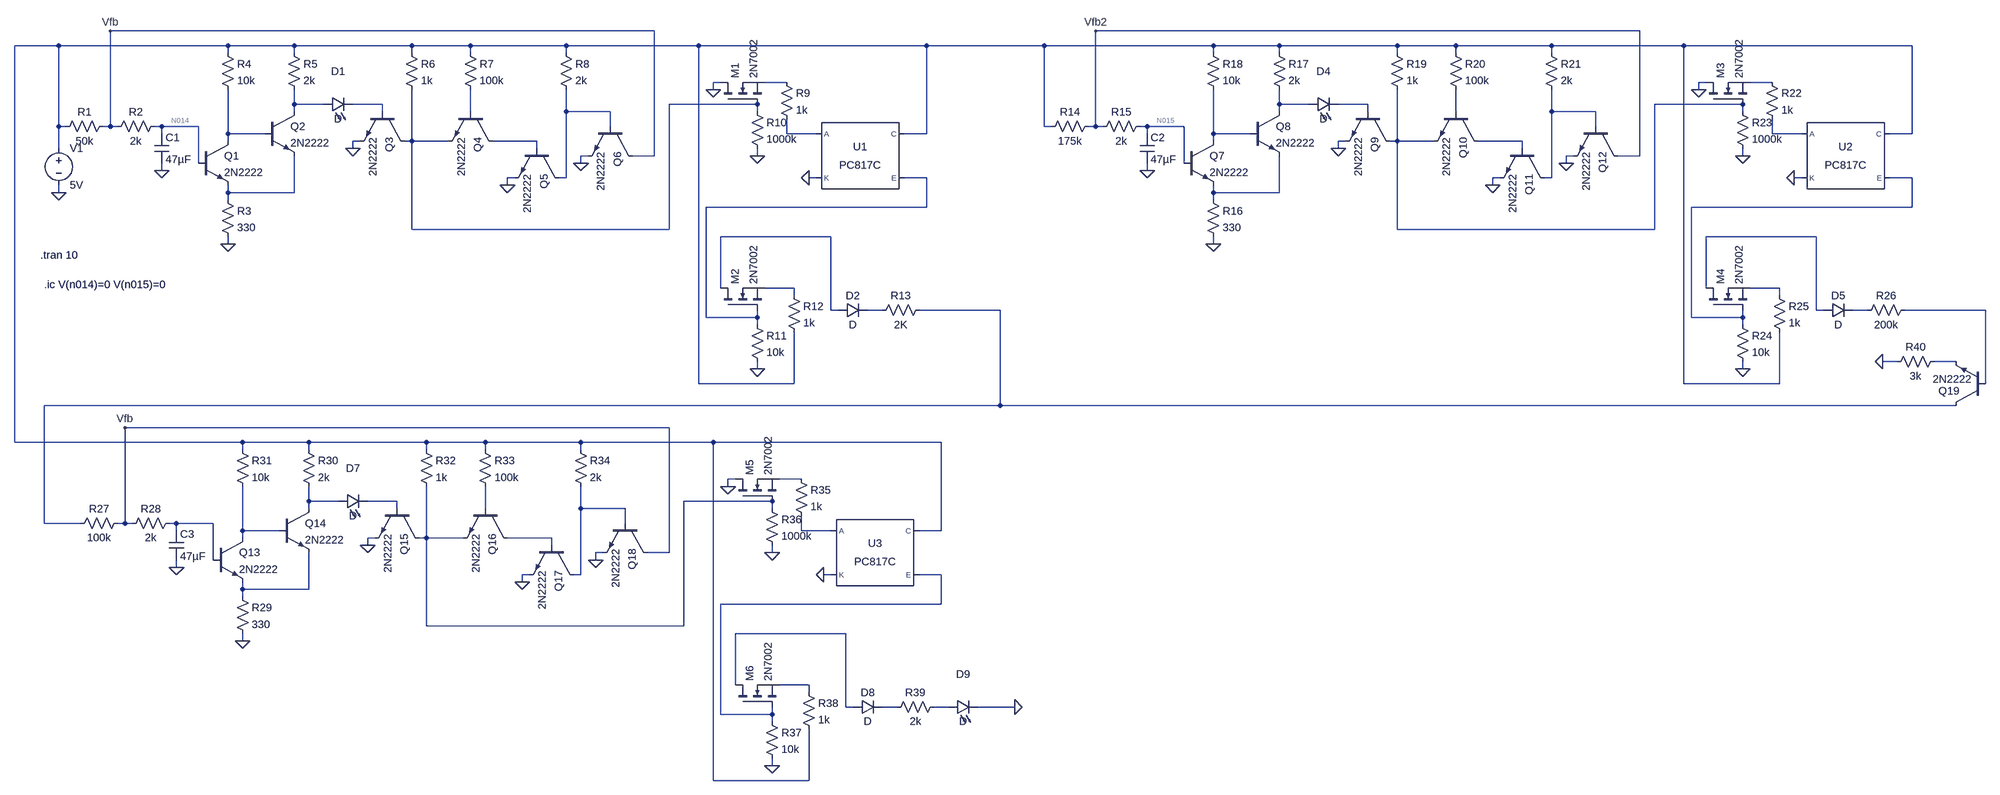
[diagram p0: schematic NeuronSynapseVersion5.asc]
NeuronSynapseVersion5.asc, the LTspice schematic file:
Version 4.1
SHEET 1 5048 1508
WIRE 1440 -128 256 -128
WIRE 3584 -128 2400 -128
WIRE 144 -96 48 -96
WIRE 512 -96 144 -96
WIRE 656 -96 512 -96
WIRE 912 -96 656 -96
WIRE 1040 -96 912 -96
WIRE 1248 -96 1040 -96
WIRE 1536 -96 1248 -96
WIRE 2032 -96 1536 -96
WIRE 2288 -96 2032 -96
WIRE 2656 -96 2288 -96
WIRE 2800 -96 2656 -96
WIRE 3056 -96 2800 -96
WIRE 3184 -96 3056 -96
WIRE 3392 -96 3184 -96
WIRE 3680 -96 3392 -96
WIRE 4176 -96 3680 -96
WIRE 512 -80 512 -96
WIRE 656 -80 656 -96
WIRE 912 -80 912 -96
WIRE 1040 -80 1040 -96
WIRE 1248 -80 1248 -96
WIRE 2656 -80 2656 -96
WIRE 2800 -80 2800 -96
WIRE 3056 -80 3056 -96
WIRE 3184 -80 3184 -96
WIRE 3392 -80 3392 -96
WIRE 1584 -16 1568 -16
WIRE 1728 -16 1680 -16
WIRE 3728 -16 3712 -16
WIRE 3872 -16 3824 -16
WIRE 1568 0 1568 -16
WIRE 3712 0 3712 -16
WIRE 656 32 656 0
WIRE 720 32 656 32
WIRE 848 32 784 32
WIRE 1664 32 1472 32
WIRE 2800 32 2800 0
WIRE 2864 32 2800 32
WIRE 2992 32 2928 32
WIRE 3808 32 3616 32
WIRE 656 48 656 32
WIRE 848 48 848 32
WIRE 1040 48 1040 0
WIRE 1248 48 1248 0
WIRE 1344 48 1248 48
WIRE 1664 48 1664 32
WIRE 2800 48 2800 32
WIRE 2992 48 2992 32
WIRE 3184 48 3184 0
WIRE 3392 48 3392 0
WIRE 3488 48 3392 48
WIRE 3808 48 3808 32
WIRE 144 80 144 -96
WIRE 160 80 144 80
WIRE 256 80 256 -128
WIRE 256 80 240 80
WIRE 272 80 256 80
WIRE 368 80 352 80
WIRE 448 80 368 80
WIRE 1344 80 1344 48
WIRE 2288 80 2288 -96
WIRE 2304 80 2288 80
WIRE 2400 80 2400 -128
WIRE 2400 80 2384 80
WIRE 2416 80 2400 80
WIRE 2512 80 2496 80
WIRE 2592 80 2512 80
WIRE 3488 80 3488 48
WIRE 368 96 368 80
WIRE 512 96 512 0
WIRE 592 96 512 96
WIRE 1728 96 1728 64
WIRE 1792 96 1728 96
WIRE 2032 96 2032 -96
WIRE 2032 96 1984 96
WIRE 2512 96 2512 80
WIRE 2656 96 2656 0
WIRE 2736 96 2656 96
WIRE 3872 96 3872 64
WIRE 3936 96 3872 96
WIRE 4176 96 4176 -96
WIRE 4176 96 4128 96
WIRE 512 112 512 96
WIRE 800 112 784 112
WIRE 912 112 912 0
WIRE 912 112 896 112
WIRE 992 112 912 112
WIRE 1184 112 1088 112
WIRE 2656 112 2656 96
WIRE 2944 112 2928 112
WIRE 3056 112 3056 0
WIRE 3056 112 3040 112
WIRE 3136 112 3056 112
WIRE 3328 112 3232 112
WIRE 144 128 144 80
WIRE 784 128 784 112
WIRE 1184 128 1184 112
WIRE 2928 128 2928 112
WIRE 3328 128 3328 112
WIRE 1296 144 1280 144
WIRE 1440 144 1440 -128
WIRE 1440 144 1392 144
WIRE 1664 144 1664 128
WIRE 3440 144 3424 144
WIRE 3584 144 3584 -128
WIRE 3584 144 3536 144
WIRE 3808 144 3808 128
WIRE 448 160 448 80
WIRE 1280 160 1280 144
WIRE 2592 160 2592 80
WIRE 3424 160 3424 144
WIRE 368 176 368 160
WIRE 2512 176 2512 160
WIRE 1136 192 1120 192
WIRE 1248 192 1248 48
WIRE 1248 192 1232 192
WIRE 1792 192 1776 192
WIRE 2032 192 1984 192
WIRE 3280 192 3264 192
WIRE 3392 192 3392 48
WIRE 3392 192 3376 192
WIRE 3936 192 3920 192
WIRE 4176 192 4128 192
WIRE 1120 208 1120 192
WIRE 3264 208 3264 192
WIRE 144 224 144 208
WIRE 512 224 512 208
WIRE 656 224 656 144
WIRE 656 224 512 224
WIRE 2656 224 2656 208
WIRE 2800 224 2800 144
WIRE 2800 224 2656 224
WIRE 512 240 512 224
WIRE 2656 240 2656 224
WIRE 2032 256 2032 192
WIRE 2032 256 1552 256
WIRE 4176 256 4176 192
WIRE 4176 256 3696 256
WIRE 912 304 912 112
WIRE 1472 304 1472 32
WIRE 1472 304 912 304
WIRE 3056 304 3056 112
WIRE 3616 304 3616 32
WIRE 3616 304 3056 304
WIRE 1824 320 1584 320
WIRE 3968 320 3728 320
WIRE 512 336 512 320
WIRE 2656 336 2656 320
WIRE 1584 432 1584 320
WIRE 1744 432 1680 432
WIRE 3728 432 3728 320
WIRE 3888 432 3824 432
WIRE 1744 448 1744 432
WIRE 3888 448 3888 432
WIRE 1824 480 1824 320
WIRE 1840 480 1824 480
WIRE 1936 480 1904 480
WIRE 2192 480 2016 480
WIRE 3968 480 3968 320
WIRE 3984 480 3968 480
WIRE 4080 480 4048 480
WIRE 4336 480 4160 480
WIRE 1552 496 1552 256
WIRE 1664 496 1664 480
WIRE 1664 496 1552 496
WIRE 3696 496 3696 256
WIRE 3808 496 3808 480
WIRE 3808 496 3696 496
WIRE 1664 512 1664 496
WIRE 3808 512 3808 496
WIRE 4144 592 4112 592
WIRE 4272 592 4224 592
WIRE 1664 608 1664 592
WIRE 3808 608 3808 592
WIRE 1536 640 1536 -96
WIRE 1744 640 1744 528
WIRE 1744 640 1536 640
WIRE 3680 640 3680 -96
WIRE 3888 640 3888 528
WIRE 3888 640 3680 640
WIRE 4336 640 4336 480
WIRE 2192 688 2192 480
WIRE 2192 688 112 688
WIRE 4272 688 2192 688
WIRE 1472 736 288 736
WIRE 48 768 48 -96
WIRE 544 768 48 768
WIRE 688 768 544 768
WIRE 944 768 688 768
WIRE 1072 768 944 768
WIRE 1280 768 1072 768
WIRE 1568 768 1280 768
WIRE 2064 768 1568 768
WIRE 544 784 544 768
WIRE 688 784 688 768
WIRE 944 784 944 768
WIRE 1072 784 1072 768
WIRE 1280 784 1280 768
WIRE 1616 848 1600 848
WIRE 1760 848 1712 848
WIRE 1600 864 1600 848
WIRE 688 896 688 864
WIRE 752 896 688 896
WIRE 880 896 816 896
WIRE 1696 896 1504 896
WIRE 688 912 688 896
WIRE 880 912 880 896
WIRE 1072 912 1072 864
WIRE 1280 912 1280 864
WIRE 1376 912 1280 912
WIRE 1696 912 1696 896
WIRE 112 944 112 688
WIRE 192 944 112 944
WIRE 288 944 288 736
WIRE 288 944 272 944
WIRE 304 944 288 944
WIRE 400 944 384 944
WIRE 480 944 400 944
WIRE 1376 944 1376 912
WIRE 400 960 400 944
WIRE 544 960 544 864
WIRE 624 960 544 960
WIRE 1760 960 1760 928
WIRE 1824 960 1760 960
WIRE 2064 960 2064 768
WIRE 2064 960 2016 960
WIRE 544 976 544 960
WIRE 832 976 816 976
WIRE 944 976 944 864
WIRE 944 976 928 976
WIRE 1024 976 944 976
WIRE 1216 976 1120 976
WIRE 816 992 816 976
WIRE 1216 992 1216 976
WIRE 1328 1008 1312 1008
WIRE 1472 1008 1472 736
WIRE 1472 1008 1424 1008
WIRE 1696 1008 1696 992
WIRE 480 1024 480 944
WIRE 1312 1024 1312 1008
WIRE 400 1040 400 1024
WIRE 1168 1056 1152 1056
WIRE 1280 1056 1280 912
WIRE 1280 1056 1264 1056
WIRE 1824 1056 1808 1056
WIRE 2064 1056 2016 1056
WIRE 1152 1072 1152 1056
WIRE 544 1088 544 1072
WIRE 688 1088 688 1008
WIRE 688 1088 544 1088
WIRE 544 1104 544 1088
WIRE 2064 1120 2064 1056
WIRE 2064 1120 1584 1120
WIRE 944 1168 944 976
WIRE 1504 1168 1504 896
WIRE 1504 1168 944 1168
WIRE 1856 1184 1616 1184
WIRE 544 1200 544 1184
WIRE 1616 1296 1616 1184
WIRE 1776 1296 1712 1296
WIRE 1776 1312 1776 1296
WIRE 1856 1344 1856 1184
WIRE 1872 1344 1856 1344
WIRE 1968 1344 1936 1344
WIRE 2080 1344 2048 1344
WIRE 2224 1344 2144 1344
WIRE 1584 1360 1584 1120
WIRE 1696 1360 1696 1344
WIRE 1696 1360 1584 1360
WIRE 1696 1376 1696 1360
WIRE 1696 1472 1696 1456
WIRE 1568 1504 1568 768
WIRE 1776 1504 1776 1392
WIRE 1776 1504 1568 1504
FLAG 144 224 0
FLAG 368 176 0
FLAG 512 336 0
FLAG 784 128 0
FLAG 1120 208 0
FLAG 1280 160 0
FLAG 1568 0 0
FLAG 1664 144 0
FLAG 256 -128 Vfb
FLAG 1664 608 0
FLAG 1776 192 0
FLAG 2512 176 0
FLAG 2656 336 0
FLAG 2928 128 0
FLAG 3264 208 0
FLAG 3424 160 0
FLAG 3712 0 0
FLAG 3808 144 0
FLAG 2400 -128 Vfb2
FLAG 3808 608 0
FLAG 3920 192 0
FLAG 400 1040 0
FLAG 544 1200 0
FLAG 816 992 0
FLAG 1152 1072 0
FLAG 1312 1024 0
FLAG 1600 864 0
FLAG 1696 1008 0
FLAG 288 736 Vfb
FLAG 1696 1472 0
FLAG 2224 1344 0
FLAG 1808 1056 0
FLAG 4112 592 0
SYMBOL voltage 144 112 R0
WINDOW 123 0 0 Left 0
WINDOW 39 0 0 Left 0
SYMATTR InstName V1
SYMATTR Value 5V
SYMBOL res 256 64 R90
WINDOW 0 0 56 VBottom 2
WINDOW 3 32 56 VTop 2
SYMATTR InstName R1
SYMATTR Value 50k
SYMBOL res 368 64 R90
WINDOW 0 0 56 VBottom 2
WINDOW 3 32 56 VTop 2
SYMATTR InstName R2
SYMATTR Value 2k
SYMBOL cap 352 96 R0
SYMATTR InstName C1
SYMATTR Value 47µF
SYMBOL npn 448 112 R0
SYMATTR InstName Q1
SYMATTR Value 2N2222
SYMBOL res 496 224 R0
SYMATTR InstName R3
SYMATTR Value 330
SYMBOL npn 592 48 R0
SYMATTR InstName Q2
SYMATTR Value 2N2222
SYMBOL res 640 -96 R0
SYMATTR InstName R5
SYMATTR Value 2k
SYMBOL res 496 -96 R0
SYMATTR InstName R4
SYMATTR Value 10k
SYMBOL LED 720 48 R270
WINDOW 0 72 32 VTop 2
WINDOW 3 0 32 VBottom 2
SYMATTR InstName D1
SYMBOL npn 896 48 R90
SYMATTR InstName Q3
SYMATTR Value 2N2222
SYMBOL res 896 -96 R0
SYMATTR InstName R6
SYMATTR Value 1k
SYMBOL npn 1088 48 R90
SYMATTR InstName Q4
SYMATTR Value 2N2222
SYMBOL res 1024 -96 R0
SYMATTR InstName R7
SYMATTR Value 100k
SYMBOL npn 1232 128 R90
SYMATTR InstName Q5
SYMATTR Value 2N2222
SYMBOL res 1232 -96 R0
SYMATTR InstName R8
SYMATTR Value 2k
SYMBOL npn 1392 80 R90
SYMATTR InstName Q6
SYMATTR Value 2N2222
SYMBOL nmos 1584 32 R270
SYMATTR InstName M1
SYMATTR Value 2N7002
SYMBOL res 1712 -32 R0
SYMATTR InstName R9
SYMATTR Value 1k
SYMBOL res 1648 32 R0
SYMATTR InstName R10
SYMATTR Value 1000k
SYMBOL Optos\\PC817C 1888 144 R0
SYMATTR InstName U1
SYMBOL nmos 1584 480 R270
SYMATTR InstName M2
SYMATTR Value 2N7002
SYMBOL res 1648 496 R0
SYMATTR InstName R11
SYMATTR Value 10k
SYMBOL res 1728 432 R0
SYMATTR InstName R12
SYMATTR Value 1k
SYMBOL diode 1840 496 R270
WINDOW 0 32 32 VTop 2
WINDOW 3 0 32 VBottom 2
SYMATTR InstName D2
SYMBOL res 2032 464 R90
WINDOW 0 0 56 VBottom 2
WINDOW 3 32 56 VTop 2
SYMATTR InstName R13
SYMATTR Value 2K
SYMBOL res 2400 64 R90
WINDOW 0 0 56 VBottom 2
WINDOW 3 32 56 VTop 2
SYMATTR InstName R14
SYMATTR Value 175k
SYMBOL res 2512 64 R90
WINDOW 0 0 56 VBottom 2
WINDOW 3 32 56 VTop 2
SYMATTR InstName R15
SYMATTR Value 2k
SYMBOL cap 2496 96 R0
SYMATTR InstName C2
SYMATTR Value 47µF
SYMBOL npn 2592 112 R0
SYMATTR InstName Q7
SYMATTR Value 2N2222
SYMBOL res 2640 224 R0
SYMATTR InstName R16
SYMATTR Value 330
SYMBOL npn 2736 48 R0
SYMATTR InstName Q8
SYMATTR Value 2N2222
SYMBOL res 2784 -96 R0
SYMATTR InstName R17
SYMATTR Value 2k
SYMBOL res 2640 -96 R0
SYMATTR InstName R18
SYMATTR Value 10k
SYMBOL LED 2864 48 R270
WINDOW 0 72 32 VTop 2
WINDOW 3 0 32 VBottom 2
SYMATTR InstName D4
SYMBOL npn 3040 48 R90
SYMATTR InstName Q9
SYMATTR Value 2N2222
SYMBOL res 3040 -96 R0
SYMATTR InstName R19
SYMATTR Value 1k
SYMBOL npn 3232 48 R90
SYMATTR InstName Q10
SYMATTR Value 2N2222
SYMBOL res 3168 -96 R0
SYMATTR InstName R20
SYMATTR Value 100k
SYMBOL npn 3376 128 R90
SYMATTR InstName Q11
SYMATTR Value 2N2222
SYMBOL res 3376 -96 R0
SYMATTR InstName R21
SYMATTR Value 2k
SYMBOL npn 3536 80 R90
SYMATTR InstName Q12
SYMATTR Value 2N2222
SYMBOL nmos 3728 32 R270
SYMATTR InstName M3
SYMATTR Value 2N7002
SYMBOL res 3856 -32 R0
SYMATTR InstName R22
SYMATTR Value 1k
SYMBOL res 3792 32 R0
SYMATTR InstName R23
SYMATTR Value 1000k
SYMBOL Optos\\PC817C 4032 144 R0
SYMATTR InstName U2
SYMBOL nmos 3728 480 R270
SYMATTR InstName M4
SYMATTR Value 2N7002
SYMBOL res 3792 496 R0
SYMATTR InstName R24
SYMATTR Value 10k
SYMBOL res 3872 432 R0
SYMATTR InstName R25
SYMATTR Value 1k
SYMBOL diode 3984 496 R270
WINDOW 0 32 32 VTop 2
WINDOW 3 0 32 VBottom 2
SYMATTR InstName D5
SYMBOL res 4176 464 R90
WINDOW 0 0 56 VBottom 2
WINDOW 3 32 56 VTop 2
SYMATTR InstName R26
SYMATTR Value 200k
SYMBOL res 288 928 R90
WINDOW 0 0 56 VBottom 2
WINDOW 3 32 56 VTop 2
SYMATTR InstName R27
SYMATTR Value 100k
SYMBOL res 400 928 R90
WINDOW 0 0 56 VBottom 2
WINDOW 3 32 56 VTop 2
SYMATTR InstName R28
SYMATTR Value 2k
SYMBOL cap 384 960 R0
SYMATTR InstName C3
SYMATTR Value 47µF
SYMBOL npn 480 976 R0
SYMATTR InstName Q13
SYMATTR Value 2N2222
SYMBOL res 528 1088 R0
SYMATTR InstName R29
SYMATTR Value 330
SYMBOL npn 624 912 R0
SYMATTR InstName Q14
SYMATTR Value 2N2222
SYMBOL res 672 768 R0
SYMATTR InstName R30
SYMATTR Value 2k
SYMBOL res 528 768 R0
SYMATTR InstName R31
SYMATTR Value 10k
SYMBOL LED 752 912 R270
WINDOW 0 72 32 VTop 2
WINDOW 3 0 32 VBottom 2
SYMATTR InstName D7
SYMBOL npn 928 912 R90
SYMATTR InstName Q15
SYMATTR Value 2N2222
SYMBOL res 928 768 R0
SYMATTR InstName R32
SYMATTR Value 1k
SYMBOL npn 1120 912 R90
SYMATTR InstName Q16
SYMATTR Value 2N2222
SYMBOL res 1056 768 R0
SYMATTR InstName R33
SYMATTR Value 100k
SYMBOL npn 1264 992 R90
SYMATTR InstName Q17
SYMATTR Value 2N2222
SYMBOL res 1264 768 R0
SYMATTR InstName R34
SYMATTR Value 2k
SYMBOL npn 1424 944 R90
SYMATTR InstName Q18
SYMATTR Value 2N2222
SYMBOL nmos 1616 896 R270
SYMATTR InstName M5
SYMATTR Value 2N7002
SYMBOL res 1744 832 R0
SYMATTR InstName R35
SYMATTR Value 1k
SYMBOL res 1680 896 R0
SYMATTR InstName R36
SYMATTR Value 1000k
SYMBOL Optos\\PC817C 1920 1008 R0
SYMATTR InstName U3
SYMBOL nmos 1616 1344 R270
SYMATTR InstName M6
SYMATTR Value 2N7002
SYMBOL res 1680 1360 R0
SYMATTR InstName R37
SYMATTR Value 10k
SYMBOL res 1760 1296 R0
SYMATTR InstName R38
SYMATTR Value 1k
SYMBOL diode 1872 1360 R270
WINDOW 0 32 32 VTop 2
WINDOW 3 0 32 VBottom 2
SYMATTR InstName D8
SYMBOL res 2064 1328 R90
WINDOW 0 0 56 VBottom 2
WINDOW 3 32 56 VTop 2
SYMATTR InstName R39
SYMATTR Value 2k
SYMBOL LED 2080 1360 R270
WINDOW 0 72 32 VTop 2
WINDOW 3 0 32 VBottom 2
SYMATTR InstName D9
SYMBOL npn 4336 688 R180
WINDOW 3 30 58 Left 2
SYMATTR InstName Q19
SYMATTR Value 2N2222
SYMBOL res 4240 576 R90
WINDOW 0 0 56 VBottom 2
WINDOW 3 32 56 VTop 2
SYMATTR InstName R40
SYMATTR Value 3k
TEXT 104 360 Left 2 !.tran 10
TEXT 112 424 Left 2 !.ic V(n014)=0 V(n015)=0

The netlist it stands for:
* NeuronSynapseVersion5.asc
V1 N001 0 5V
R1 Vfb N001 50k
R2 N014 Vfb 2k
C1 N014 0 47µF
Q1 N016 N014 N024 0 2N2222
R3 N024 0 330
Q2 N004 N016 N024 0 2N2222
R5 N001 N004 2k
R4 N001 N016 10k
D1 N004 N005 D
Q3 N006 N005 0 0 2N2222
R6 N001 N006 1k
Q4 N020 N010 N006 0 2N2222
R7 N001 N010 100k
Q5 N011 N020 0 0 2N2222
R8 N001 N011 2k
Q6 Vfb N011 0 0 2N2222
M1 0 N006 N002 N002 2N7002
R9 N002 N017 1k
R10 N006 0 1000k
X§U1 N017 0 N001 N022 PC817 Igain=2.3m  ; PC817C, pins A K C E
M2 N026 N022 N028 N028 2N7002
R11 N022 0 10k
R12 N028 N001 1k
D2 N026 N030 D
R13 N031 N030 2K
R14 Vfb2 N001 175k
R15 N015 Vfb2 2k
C2 N015 0 47µF
Q7 N018 N015 N025 0 2N2222
R16 N025 0 330
Q8 N007 N018 N025 0 2N2222
R17 N001 N007 2k
R18 N001 N018 10k
D4 N007 N008 D
Q9 N009 N008 0 0 2N2222
R19 N001 N009 1k
Q10 N021 N012 N009 0 2N2222
R20 N001 N012 100k
Q11 N013 N021 0 0 2N2222
R21 N001 N013 2k
Q12 Vfb2 N013 0 0 2N2222
M3 0 N009 N003 N003 2N7002
R22 N003 N019 1k
R23 N009 0 1000k
X§U2 N019 0 N001 N023 PC817 Igain=2.3m  ; PC817C, pins A K C E
M4 N027 N023 N029 N029 2N7002
R24 N023 0 10k
R25 N029 N001 1k
D5 N027 N032 D
R26 N033 N032 200k
R27 Vfb N031 100k
R28 N041 Vfb 2k
C3 N041 0 47µF
Q13 N042 N041 N046 0 2N2222
R29 N046 0 330
Q14 N036 N042 N046 0 2N2222
R30 N001 N036 2k
R31 N001 N042 10k
D7 N036 N037 D
Q15 N038 N037 0 0 2N2222
R32 N001 N038 1k
Q16 N044 N039 N038 0 2N2222
R33 N001 N039 100k
Q17 N040 N044 0 0 2N2222
R34 N001 N040 2k
Q18 Vfb N040 0 0 2N2222
M5 0 N038 N035 N035 2N7002
R35 N035 N043 1k
R36 N038 0 1000k
X§U3 N043 0 N001 N045 PC817 Igain=2.3m  ; PC817C, pins A K C E
M6 N047 N045 N048 N048 2N7002
R37 N045 0 10k
R38 N048 N001 1k
D8 N047 N049 D
R39 N050 N049 2k
D9 N050 0 D
Q19 N031 N033 N034 0 2N2222
R40 N034 0 3k
.model D D
.lib standard.dio
.model NPN NPN
.model PNP PNP
.lib standard.bjt
.model NMOS NMOS
.model PMOS PMOS
.lib standard.mos
.tran 10
.ic V(n014)=0 V(n015)=0
.lib PC817.sub
.backanno
.end